# Altium schematic sheet 海关全向本体电路板V3_TTL通信.SchDoc
size A4
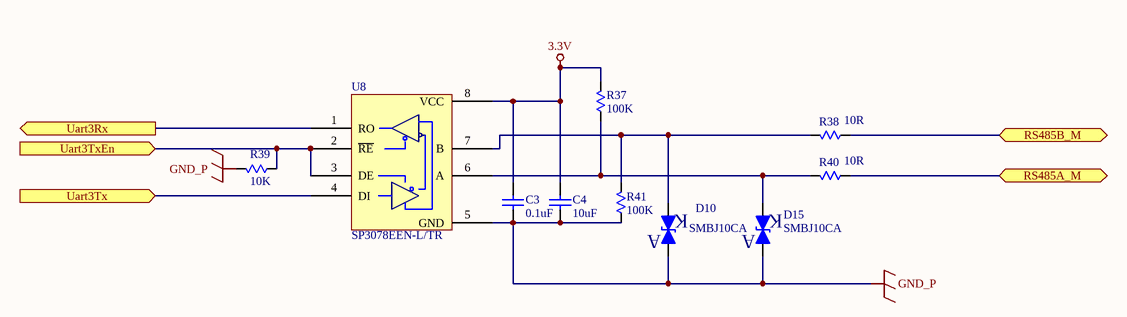
[diagram p0: 海关全向本体电路板V3_TTL通信.SchDoc]

## Parts
C3  0.1uF  [C0603-S]
C4  10uF  [C0603-S]
D10  SMBJ10CA  [SMB-S]
D15  SMBJ10CA  [SMB-S]
R37  100K  [R0603-S]
R38  10R  [R1206-S]
R39  10K  [R0603-S]
R40  10R  [R1206-S]
R41  100K  [R0603-S]
U8  SP3078EEN-L/TR  [SO8-150]

## Ports
RS485A_M (bidir), RS485B_M (bidir), Uart3Rx (out), Uart3Tx (in), Uart3TxEn (in)

## Nets
3.3V: C3.2 C4.2 R37.2 U8.8(VCC)
GND_P: C3.1 C4.1 D10.1(A) D15.1(A) R39.2 R41.1 U8.5(GND)
RS485A_M: R40.1 ; port RS485A_M
RS485B_M: R38.1 ; port RS485B_M
Uart3Rx: U8.1(RO) ; port Uart3Rx
Uart3Tx: U8.4(DI) ; port Uart3Tx
Uart3TxEn: R39.1 U8.2(~{RE}) U8.3(DE) ; port Uart3TxEn
NetD10_2: D10.2(K) R38.2 R41.2 U8.7(B)
NetD15_2: D15.2(K) R37.1 R40.2 U8.6(A)

## Library data of the parts
C3 C4 = CAP: Published: 8-Jun-2000; LatestRevisionDate: 17-Jul-2002; LatestRevisionNote: Re-released for DXP Platform.; PackageReference: RAD-0.3; Publisher: Altium Limited
  C3: Value: 0.1uF
  C4: Value: 10uF
D10 D15 = BS0300N
R37-R41 = RES: Resistor; Published: 8-Jun-2000; LatestRevisionDate: 17-Jul-2002; LatestRevisionNote: Re-released for DXP Platform.; PackageReference: AXIAL-0.3; Publisher: Altium Limited
  R37 R41: Value: 100K
  R38 R40: Value: 10R
  R39: Value: 10K
U8 = SP3078EEN